# Altium project Ultimaker.PrjPcb (part 1 of 2)
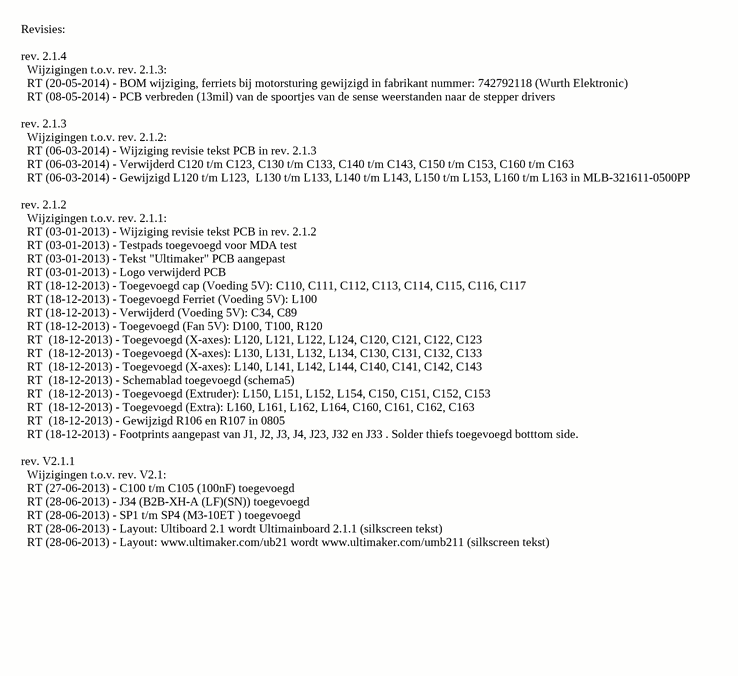
[diagram p0: revisies.SchDoc]
Projectnaam: Bla
6 sheets, 574 parts. Net scope: global (net labels, ports and power ports of the same name join across sheets).
Board file: Ultimaker_V2.1.4.PcbDoc
Sheets:
  revisies.SchDoc
  schema1.SchDoc
  schema2.SchDoc
  schema3.SchDoc
  schema4.SchDoc
  schema5.SchDoc

## Sheet revisies.SchDoc
size A3; ApprovedBy: CdB; CheckedBy: CdB; DrawnBy: RT; Engineer: CdB; Organization: Faber Electronics B.V.; Address1: Th. Dobbeweg 1,; Address2: 6883 GN Velp,; Address3: Netherlands; Address4: T: 026-38 46 800; DocumentNumber: 6; Revision: 2.1.3; SheetNumber: 6; SheetTotal: 6; Status: Final

### Notes on the sheet
- Revisies:
  rev. 2.1.4
  Wijzigingen t.o.v. rev. 2.1.3:
  RT (20-05-2014) - BOM wijziging, ferriets bij motorsturing gewijzigd in fabrikant nummer: 742792118 (Wurth Elektronic)
  RT (08-05-2014) - PCB verbreden (13mil) van de spoortjes van de sense weerstanden naar de stepper drivers
  rev. 2.1.3
  Wijzigingen t.o.v. rev. 2.1.2:
  RT (06-03-2014) - Wijziging revisie tekst PCB in rev. 2.1.3
  RT (06-03-2014) - Verwijderd C120 t/m C123, C130 t/m C133, C140 t/m C143, C150 t/m C153, C160 t/m C163
  RT (06-03-2014) - Gewijzigd L120 t/m L123,  L130 t/m L133, L140 t/m L143, L150 t/m L153, L160 t/m L163 in MLB-321611-0500PP
  rev. 2.1.2
  Wijzigingen t.o.v. rev. 2.1.1:
  RT (03-01-2013) - Wijziging revisie tekst PCB in rev. 2.1.2
  RT (03-01-2013) - Testpads toegevoegd voor MDA test
  RT (03-01-2013) - Tekst "Ultimaker" PCB aangepast
  RT (03-01-2013) - Logo verwijderd PCB
  RT (18-12-2013) - Toegevoegd cap (Voeding 5V): C110, C111, C112, C113, C114, C115, C116, C117
  RT (18-12-2013) - Toegevoegd Ferriet (Voeding 5V): L100
  RT (18-12-2013) - Verwijderd (Voeding 5V): C34, C89
  RT (18-12-2013) - Toegevoegd (Fan 5V): D100, T100, R120
  RT  (18-12-2013) - Toegevoegd (X-axes): L120, L121, L122, L124, C120, C121, C122, C123
  RT  (18-12-2013) - Toegevoegd (X-axes): L130, L131, L132, L134, C130, C131, C132, C133
  RT  (18-12-2013) - Toegevoegd (X-axes): L140, L141, L142, L144, C140, C141, C142, C143
  RT  (18-12-2013) - Schemablad toegevoegd (schema5)
  RT  (18-12-2013) - Toegevoegd (Extruder): L150, L151, L152, L154, C150, C151, C152, C153
  RT  (18-12-2013) - Toegevoegd (Extra): L160, L161, L162, L164, C160, C161, C162, C163
  RT  (18-12-2013) - Gewijzigd R106 en R107 in 0805
  RT (18-12-2013) - Footprints aangepast van J1, J2, J3, J4, J23, J32 en J33 . Solder thiefs toegevoegd botttom side.
  rev. V2.1.1
  Wijzigingen t.o.v. rev. V2.1:
  RT (27-06-2013) - C100 t/m C105 (100nF) toegevoegd
  RT (28-06-2013) - J34 (B2B-XH-A (LF)(SN)) toegevoegd
  RT (28-06-2013) - SP1 t/m SP4 (M3-10ET ) toegevoegd
  RT (28-06-2013) - Layout: Ultiboard 2.1 wordt Ultimainboard 2.1.1 (silkscreen tekst)
  RT (28-06-2013) - Layout: www.ultimaker.com/ub21 wordt www.ultimaker.com/umb211 (silkscreen tekst)
- Project name
- Document Name
- Revision:
- Date:
- Status:
- Engineer:
- Drawing by:
- Time:
- Approved By:
- Checked By:
- Date of approval:
- Sheet
- of
- Size:
- A3
- File:
- F: 026-36 48 244

## Sheet schema1.SchDoc
size A3; ApprovedBy: CdB; CheckedBy: CdB; DrawnBy: RT; Engineer: CdB; Organization: Faber Electronics B.V.; Address1: Th. Dobbeweg 1,; Address2: 6883 GN Velp,; Address3: Netherlands; Address4: T: 026-38 46 800; DocumentNumber: 1; Revision: 2.1.4; SheetNumber: 1; SheetTotal: 6; Status: Final; PageSetup: Record=PageOptions|CenterHorizontal=True|CenterVertical=True|PrintScale=1.01|XCorrection=1.00|YCorrection=1.00|PrintKind=1|BorderSize=5000000|LeftOffset=0|BottomOffset=0|Orientation=2|PaperLength=1000|PaperWidth=1000|Scale=100|PaperSource=7|PrintQuality=1200|MediaType=1|DitherType=10|PaperKind=A3 (297 x 420mm)|PrintScaleMode=1
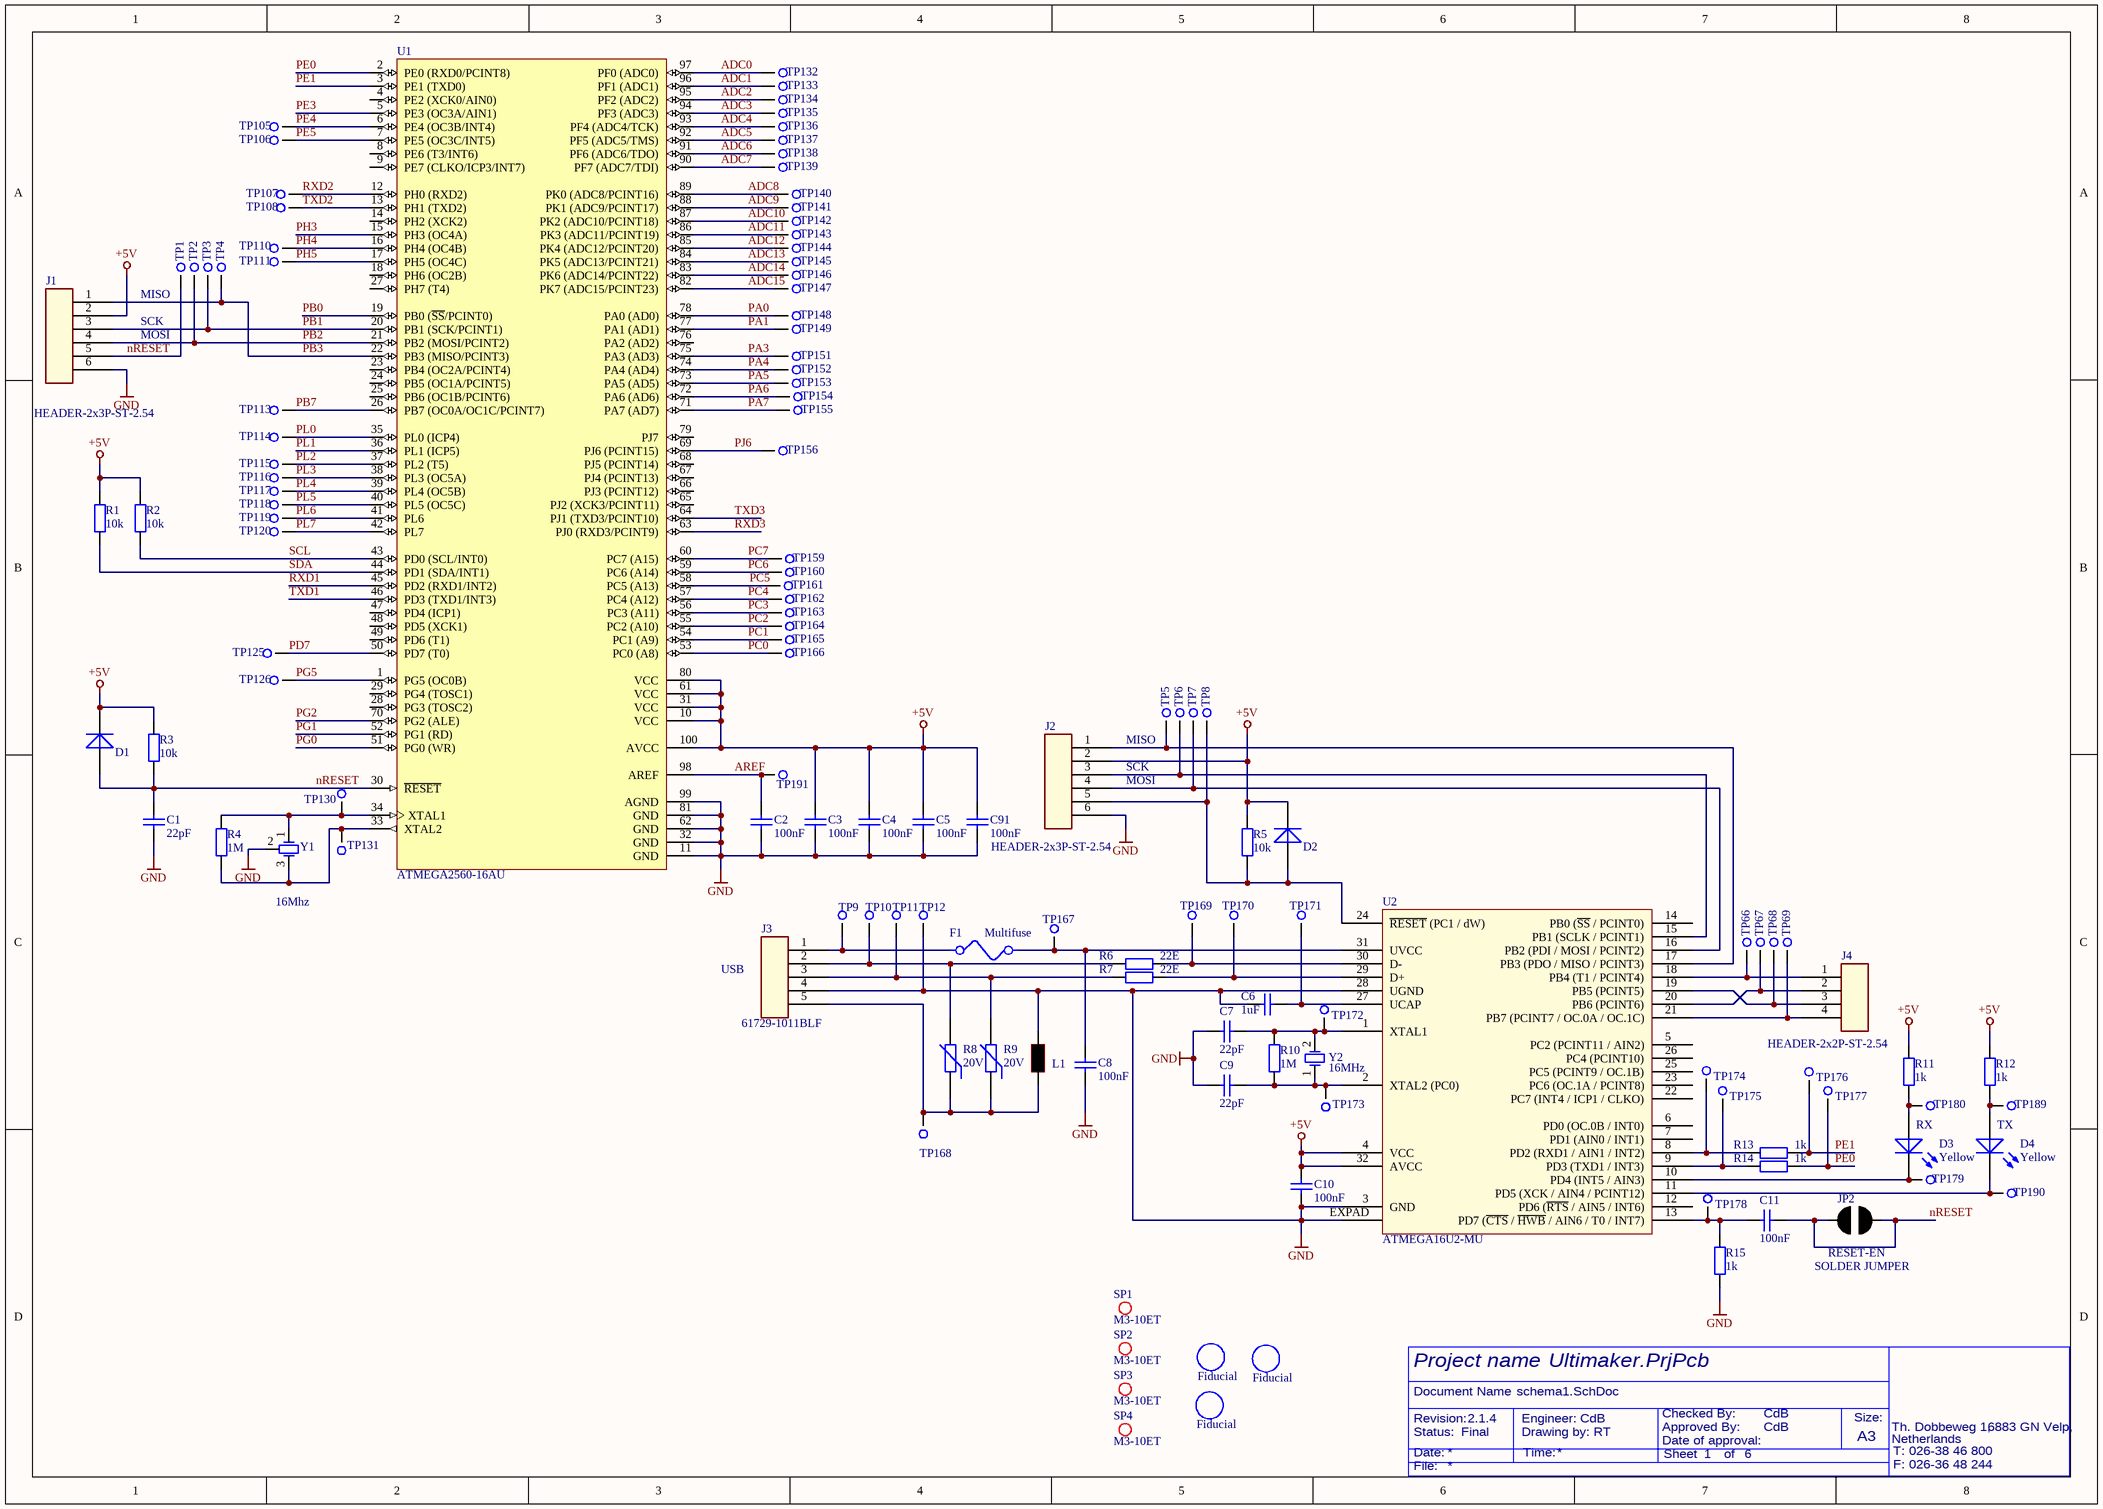
[diagram p1: schema1.SchDoc]

### Parts
C1  22pF  [C0603]
C2  100nF  [C0603]
C3  100nF  [C0603]
C4  100nF  [C0603]
C5  100nF  [C0603]
C6  1uF  [C0603]
C7  22pF  [C0603]
C8  100nF  [C0603]
C9  22pF  [C0603]
C10  100nF  [C0603]
C11  100nF  [C0603]
C91  100nF  [C0603]
D1  1N4148  [SOD323]  (value not drawn)
D2  1N4148  [SOD323]  (value not drawn)
D3  Yellow  [LED0805-YELLOW]
D4  Yellow  [LED0805-YELLOW]
F1  Multifuse  [Multifuse1812]
Fid1  Fiducial  [Fiducial]  (no BOM)
Fid2  Fiducial  [Fiducial]  (no BOM)
Fid3  Fiducial  [Fiducial]  (no BOM)
J1  HEADER-2x3P-ST-2.54  [HEADER-2x3P-ST-2.54]
J2  HEADER-2x3P-ST-2.54  [HEADER-2x3P-ST-2.54]
J3  61729-1011BLF  [61729-1011BLF]
J4  HEADER-2x2P-ST-2.54  [HEADER-2x2P-ST-2.54]
JP2  SOLDER JUMPER  [JUMPER 2 SOLDER]
L1  Bead  [L0805]  (value not drawn)
R1  10k  [R0603]
R2  10k  [R0603]
R3  10k  [R0603]
R4  1M  [R0603]
R5  10k  [R0603]
R6  22E  [R0603]
R7  22E  [R0603]
R8  20V  [R0603]
R9  20V  [R0603]
R10  1M  [R0603]
R11  1k  [R0603]
R12  1k  [R0603]
R13  1k  [R0603]
R14  1k  [R0603]
R15  1k  [R0603]
SP1  M3-10ET  [Spacer M3-10ET]
SP2  M3-10ET  [Spacer M3-10ET]
SP3  M3-10ET  [Spacer M3-10ET]
SP4  M3-10ET  [Spacer M3-10ET]
TP1  Testpoint  [Testpoint]  (value not drawn)
TP2  Testpoint  [Testpoint]  (value not drawn)
TP3  Testpoint  [Testpoint]  (value not drawn)
TP4  Testpoint  [Testpoint]  (value not drawn)
TP5  Testpoint  [Testpoint]  (value not drawn)
TP6  Testpoint  [Testpoint]  (value not drawn)
TP7  Testpoint  [Testpoint]  (value not drawn)
TP8  Testpoint  [Testpoint]  (value not drawn)
TP9  Testpoint  [Testpoint]  (value not drawn)
TP10  Testpoint  [Testpoint]  (value not drawn)
TP11  Testpoint  [Testpoint]  (value not drawn)
TP12  Testpoint  [Testpoint]  (value not drawn)
TP66  Testpoint  [Testpoint]  (value not drawn)
TP67  Testpoint  [Testpoint]  (value not drawn)
TP68  Testpoint  [Testpoint]  (value not drawn)
TP69  Testpoint  [Testpoint]  (value not drawn)
TP105  Testpoint 1.6mm  [Testpoint 1.6mm]  (value not drawn)
TP106  Testpoint 1.6mm  [Testpoint 1.6mm]  (value not drawn)
TP107  Testpoint 1.6mm  [Testpoint 1.6mm]  (value not drawn)
TP108  Testpoint 1.6mm  [Testpoint 1.6mm]  (value not drawn)
TP110  Testpoint 1.6mm  [Testpoint 1.6mm]  (value not drawn)
TP111  Testpoint 1.6mm  [Testpoint 1.6mm]  (value not drawn)
TP113  Testpoint 1.6mm  [Testpoint 1.6mm]  (value not drawn)
TP114  Testpoint 1.6mm  [Testpoint 1.6mm]  (value not drawn)
TP115  Testpoint 1.6mm  [Testpoint 1.6mm]  (value not drawn)
TP116  Testpoint 1.6mm  [Testpoint 1.6mm]  (value not drawn)
TP117  Testpoint 1.6mm  [Testpoint 1.6mm]  (value not drawn)
TP118  Testpoint 1.6mm  [Testpoint 1.6mm]  (value not drawn)
TP119  Testpoint 1.6mm  [Testpoint 1.6mm]  (value not drawn)
TP120  Testpoint 1.6mm  [Testpoint 1.6mm]  (value not drawn)
TP125  Testpoint 1.6mm  [Testpoint 1.6mm]  (value not drawn)
TP126  Testpoint 1.6mm  [Testpoint 1.6mm]  (value not drawn)
TP130  Testpoint 1.6mm  [Testpoint 1.6mm]  (value not drawn)
TP131  Testpoint 1.6mm  [Testpoint 1.6mm]  (value not drawn)
TP132  Testpoint 1.6mm  [Testpoint 1.6mm]  (value not drawn)
TP133  Testpoint 1.6mm  [Testpoint 1.6mm]  (value not drawn)
TP134  Testpoint 1.6mm  [Testpoint 1.6mm]  (value not drawn)
TP135  Testpoint 1.6mm  [Testpoint 1.6mm]  (value not drawn)
TP136  Testpoint 1.6mm  [Testpoint 1.6mm]  (value not drawn)
TP137  Testpoint 1.6mm  [Testpoint 1.6mm]  (value not drawn)
TP138  Testpoint 1.6mm  [Testpoint 1.6mm]  (value not drawn)
TP139  Testpoint 1.6mm  [Testpoint 1.6mm]  (value not drawn)
TP140  Testpoint 1.6mm  [Testpoint 1.6mm]  (value not drawn)
TP141  Testpoint 1.6mm  [Testpoint 1.6mm]  (value not drawn)
TP142  Testpoint 1.6mm  [Testpoint 1.6mm]  (value not drawn)
TP143  Testpoint 1.6mm  [Testpoint 1.6mm]  (value not drawn)
TP144  Testpoint 1.6mm  [Testpoint 1.6mm]  (value not drawn)
TP145  Testpoint 1.6mm  [Testpoint 1.6mm]  (value not drawn)
TP146  Testpoint 1.6mm  [Testpoint 1.6mm]  (value not drawn)
TP147  Testpoint 1.6mm  [Testpoint 1.6mm]  (value not drawn)
TP148  Testpoint 1.6mm  [Testpoint 1.6mm]  (value not drawn)
TP149  Testpoint 1.6mm  [Testpoint 1.6mm]  (value not drawn)
TP151  Testpoint 1.6mm  [Testpoint 1.6mm]  (value not drawn)
TP152  Testpoint 1.6mm  [Testpoint 1.6mm]  (value not drawn)
TP153  Testpoint 1.6mm  [Testpoint 1.6mm]  (value not drawn)
TP154  Testpoint 1.6mm  [Testpoint 1.6mm]  (value not drawn)
TP155  Testpoint 1.6mm  [Testpoint 1.6mm]  (value not drawn)
TP156  Testpoint 1.6mm  [Testpoint 1.6mm]  (value not drawn)
TP159  Testpoint 1.6mm  [Testpoint 1.6mm]  (value not drawn)
TP160  Testpoint 1.6mm  [Testpoint 1.6mm]  (value not drawn)
TP161  Testpoint 1.6mm  [Testpoint 1.6mm]  (value not drawn)
TP162  Testpoint 1.6mm  [Testpoint 1.6mm]  (value not drawn)
TP163  Testpoint 1.6mm  [Testpoint 1.6mm]  (value not drawn)
TP164  Testpoint 1.6mm  [Testpoint 1.6mm]  (value not drawn)
TP165  Testpoint 1.6mm  [Testpoint 1.6mm]  (value not drawn)
TP166  Testpoint 1.6mm  [Testpoint 1.6mm]  (value not drawn)
TP167  Testpoint 1.6mm  [Testpoint 1.6mm]  (value not drawn)
TP168  Testpoint 1.6mm  [Testpoint 1.6mm]  (value not drawn)
TP169  Testpoint 1.6mm  [Testpoint 1.6mm]  (value not drawn)
TP170  Testpoint 1.6mm  [Testpoint 1.6mm]  (value not drawn)
TP171  Testpoint 1.6mm  [Testpoint 1.6mm]  (value not drawn)
TP172  Testpoint 1.6mm  [Testpoint 1.6mm]  (value not drawn)
TP173  Testpoint 1.6mm  [Testpoint 1.6mm]  (value not drawn)
TP174  Testpoint 1.6mm  [Testpoint 1.6mm]  (value not drawn)
TP175  Testpoint 1.6mm  [Testpoint 1.6mm]  (value not drawn)
TP176  Testpoint 1.6mm  [Testpoint 1.6mm]  (value not drawn)
TP177  Testpoint 1.6mm  [Testpoint 1.6mm]  (value not drawn)
TP178  Testpoint 1.6mm  [Testpoint 1.6mm]  (value not drawn)
TP179  Testpoint 1.6mm  [Testpoint 1.6mm]  (value not drawn)
TP180  Testpoint 1.6mm  [Testpoint 1.6mm]  (value not drawn)
TP189  Testpoint 1.6mm  [Testpoint 1.6mm]  (value not drawn)
TP190  Testpoint 1.6mm  [Testpoint 1.6mm]  (value not drawn)
TP191  Testpoint 1.6mm  [Testpoint 1.6mm]  (value not drawn)
U1  ATMEGA2560-16AU  [TSQFP50P1600X1600X120-100N]
U2  ATMEGA16U2-MU  [QFN50P500X500X100-32-EX]
Y1  16Mhz  [CSTC]
Y2  16MHz  [XT49M-2016M]

### Nets
+5V: C3.2 C4.2 C5.2 C10.2 C91.2 D1.2(K) D2.2(K) J1.2 J2.2 R1.1 R2.1 R3.2 R5.1 R11.2 R12.2 U1.10(VCC) U1.31(VCC) U1.61(VCC) U1.80(VCC) U1.100(AVCC) U2.4(VCC) U2.32(AVCC)
GND: C1.1 C2.1 C3.1 C4.1 C5.1 C6.1 C7.1 C8.1 C9.1 C10.1 C91.1 J1.6 J2.6 J3.4 L1.1 R15.2 TP12.1 U1.11(GND) U1.32(GND) U1.62(GND) U1.81(GND) U1.99(AGND) U2.3(GND) U2.28(UGND) U2.EXPAD Y1.2
ADC0: TP132.1 U1.97(PF0_(ADC0))
ADC1: TP133.1 U1.96(PF1_(ADC1))
ADC2: TP134.1 U1.95(PF2_(ADC2))
ADC3: TP135.1 U1.94(PF3_(ADC3))
ADC4: TP136.1 U1.93(PF4_(ADC4/TCK))
ADC5: TP137.1 U1.92(PF5_(ADC5/TMS))
ADC6: TP138.1 U1.91(PF6_(ADC6/TDO))
ADC7: TP139.1 U1.90(PF7_(ADC7/TDI))
ADC8: TP140.1 U1.89(PK0_(ADC8/PCINT16))
ADC9: TP141.1 U1.88(PK1_(ADC9/PCINT17))
ADC10: TP142.1 U1.87(PK2_(ADC10/PCINT18))
ADC11: TP143.1 U1.86(PK3_(ADC11/PCINT19))
ADC12: TP144.1 U1.85(PK4_(ADC12/PCINT20))
ADC13: TP145.1 U1.84(PK5_(ADC13/PCINT21))
ADC14: TP146.1 U1.83(PK6_(ADC14/PCINT22))
ADC15: TP147.1 U1.82(PK7_(ADC15/PCINT23))
AREF: C2.2 TP191.1 U1.98(AREF)
nRESET: C1.2 C11.1 D1.1(A) J1.5 JP2.1 JP2.2 R3.1 TP1.1 U1.30(~{RESET})
PA0: TP148.1 U1.78(PA0_(AD0))
PA1: TP149.1 U1.77(PA1_(AD1))
PA3: TP151.1 U1.75(PA3_(AD3))
PA4: TP152.1 U1.74(PA4_(AD4))
PA5: TP153.1 U1.73(PA5_(AD5))
PA6: TP154.1 U1.72(PA6_(AD6))
PA7: TP155.1 U1.71(PA7_(AD7))
PB0: U1.19(PB0_(~{SS}/PCINT0))
PB1: J1.3 TP3.1 U1.20(PB1_(SCK/PCINT1))
PB2: J1.4 TP2.1 U1.21(PB2_(MOSI/PCINT2))
PB3: J1.1 TP4.1 U1.22(PB3_(MISO/PCINT3))
PB7: TP113.1 U1.26(PB7_(OC0A/OC1C/PCINT7))
PC0: TP166.1 U1.53(PC0_(A8))
PC1: TP165.1 U1.54(PC1_(A9))
PC2: TP164.1 U1.55(PC2_(A10))
PC3: TP163.1 U1.56(PC3_(A11))
PC4: TP162.1 U1.57(PC4_(A12))
PC5: TP161.1 U1.58(PC5_(A13))
PC6: TP160.1 U1.59(PC6_(A14))
PC7: TP159.1 U1.60(PC7_(A15))
PD7: TP125.1 U1.50(PD7_(T0))
PE0: R14.2 TP177.1 U1.2(PE0_(RXD0/PCINT8))
PE1: R13.2 TP176.1 U1.3(PE1_(TXD0))
PE3: U1.5(PE3_(OC3A/AIN1))
PE4: TP105.1 U1.6(PE4_(OC3B/INT4))
PE5: TP106.1 U1.7(PE5_(OC3C/INT5))
PG0: U1.51(PG0_(WR))
PG1: U1.52(PG1_(RD))
PG2: U1.70(PG2_(ALE))
PG5: TP126.1 U1.1(PG5_(OC0B))
PH3: U1.15(PH3_(OC4A))
PH4: TP110.1 U1.16(PH4_(OC4B))
PH5: TP111.1 U1.17(PH5_(OC4C))
PJ6: TP156.1 U1.69(PJ6_(PCINT15))
PL0: TP114.1 U1.35(PL0_(ICP4))
PL1: U1.36(PL1_(ICP5))
PL2: TP115.1 U1.37(PL2_(T5))
PL3: TP116.1 U1.38(PL3_(OC5A))
PL4: TP117.1 U1.39(PL4_(OC5B))
PL5: TP118.1 U1.40(PL5_(OC5C))
PL6: TP119.1 U1.41(PL6)
PL7: TP120.1 U1.42(PL7)
RXD1: U1.45(PD2_(RXD1/INT2))
RXD2: TP107.1 U1.12(PH0_(RXD2))
RXD3: U1.63(PJ0_(RXD3/PCINT9))
SCL: R2.2 U1.43(PD0_(SCL/INT0))
SDA: R1.2 U1.44(PD1_(SDA/INT1))
TXD1: U1.46(PD3_(TXD1/INT3))
TXD2: TP108.1 U1.13(PH1_(TXD2))
TXD3: U1.64(PJ1_(TXD3/PCINT10))
NetC6_2: C6.2 TP171.1 U2.27(UCAP)
NetC7_2: C7.2 R10.2 TP172.1 U2.1(XTAL1) Y2.2
NetC8_2: C8.2 F1.2 TP167.1 U2.31(UVCC)
NetC9_2: C9.2 R10.1 TP173.1 U2.2(XTAL2_(PC0)) Y2.1
NetC11_2: C11.2 R15.1 TP178.1 U2.13(PD7_(~{CTS}_/_~{HWB}_/_AIN6_/_T0_/_INT7))
NetD2_1: D2.1(A) J2.5 R5.2 TP8.1 U2.24(~{RESET}_(PC1_/_dW))
NetD3_1: D3.1(A) R11.1 TP180.1
NetD3_2: D3.2(K) TP179.1 U2.10(PD4_(INT5_/_AIN3))
NetD4_1: D4.1(A) R12.1 TP189.1
NetD4_2: D4.2(K) TP190.1 U2.11(PD5_(XCK_/_AIN4_/_PCINT12))
NetF1_1: F1.1 J3.1 TP9.1
NetJ2_1: J2.1 TP5.1 U2.17(PB3_(PDO_/_MISO_/_PCINT3))
NetJ2_3: J2.3 TP6.1 U2.15(PB1_(SCLK_/_PCINT1))
NetJ2_4: J2.4 TP7.1 U2.16(PB2_(PDI_/_MOSI_/_PCINT2))
NetJ3_2: J3.2 R6.1 R8.2 TP10.1
NetJ3_3: J3.3 R7.1 R9.2 TP11.1
NetJ3_5: J3.5 L1.2 R8.1 R9.1 TP168.1
NetJ4_1: J4.1 TP66.1 U2.18(PB4_(T1_/_PCINT4))
NetJ4_2: J4.2 TP67.1 U2.20(PB6_(PCINT6))
NetJ4_3: J4.3 TP68.1 U2.19(PB5_(PCINT5))
NetJ4_4: J4.4 TP69.1 U2.21(PB7_(PCINT7_/_OC.0A_/_OC.1C))
NetR4_1: R4.1 TP131.1 U1.33(XTAL2) Y1.3
NetR4_2: R4.2 TP130.1 U1.34(XTAL1) Y1.1
NetR6_2: R6.2 TP169.1 U2.30(D-)
NetR7_2: R7.2 TP170.1 U2.29(D+)
NetR13_1: R13.1 TP174.1 U2.8(PD2_(RXD1_/_AIN1_/_INT2))
NetR14_1: R14.1 TP175.1 U2.9(PD3_(TXD1_/_INT3))

Not connected (* = marked no-connect by the designer): U1 4(PE2_(XCK0/AIN0)) 8(PE6_(T3/INT6)) 9(PE7_(CLKO/ICP3/INT7)) 14(PH2_(XCK2)) 18(PH6_(OC2B)) 23(PB4_(OC2A/PCINT4)) 24(PB5_(OC1A/PCINT5)) 25(PB6_(OC1B/PCINT6)) 27(PH7_(T4)) 28(PG3_(TOSC2)) 29(PG4_(TOSC1)) 47(PD4_(ICP1)) 48(PD5_(XCK1)) 49(PD6_(T1)) 65(PJ2_(XCK3/PCINT11)) 66(PJ3_(PCINT12)) 67(PJ4_(PCINT13)) 68(PJ5_(PCINT14)) 76(PA2_(AD2)) 79(PJ7); U2 5(PC2_(PCINT11_/_AIN2)) 6(PD0_(OC.0B_/_INT0)) 7(PD1_(AIN0_/_INT1)) 12(PD6_(~{RTS}_/_AIN5_/_INT6)) 14(PB0_(~{SS}_/_PCINT0)) 22(PC7_(INT4_/_ICP1_/_CLKO)) 23(PC6_(OC.1A_/_PCINT8)) 25(PC5_(PCINT9_/_OC.1B)) 26(PC4_(PCINT10))

### Notes on the sheet
- MISO
- SCK
- MOSI
- (near J3) USB
- RX
- TX
- (near JP2) RESET-EN
- Project name
- Document Name
- Revision:
- Date:
- Status:
- Engineer:
- Drawing by:
- Time:
- Approved By:
- Checked By:
- Date of approval:
- Sheet
- of
- Size:
- A3
- File:
- F: 026-36 48 244

### Library data of the parts
C1 C7 C9 = Library_CAP-0008: RO C0G 22pF 2% 50V  0603; Faber ItemCode: 35321100; ID: Library_CAP-0008; Value: 22pF
C2-C5 C8 C10 C11 C91 = Library_CAP-0002: RO X7R 100nF 10% 50V 0603; Faber ItemCode: 45068500; ID: Library_CAP-0002; Value: 100nF
C6 = Library_CAP-0006: RO X5R 1uF 10% 10V 0603; Faber ItemCode: 36310600; ID: Library_CAP-0006; Value: 1uF
D1 D2 = Library_DIO-0002: RO DIODE 1N4148WS-V-GS08 SOT-323  VISHAY; Faber ItemCode: 36650500; Info: Small Signal Fast Switching Diode; Mfg: VISHAY; ID: Library_DIO-0002; Value: 1N4148
D3 D4 = Library_LED-0003: RO LED GEEL HSMY-C170 0805  AVAGO; Faber ItemCode: 35160800; ID: Library_LED-0003; Mfg: AVAGO; Mfg code: HSMY-C170; Value: Yellow
F1 = Library_FUSE-0001: RO ZEK MULTI 500MA SMD 1812 MF-MSMF050-2 BOURNS; Faber ItemCode: 35502800; Info: MULTIFUSE, SMD, 0.5A; Value: 0.5A; ID: Library_FUSE-0001; Mfg: BOURNS; Mfg code: MF-MSMF050-2
Fid1-Fid3 = Library_MISC-0003: ID: Library_MISC-0003; Faber ItemCode: -; Mfg: -; Mfg code: -; Value: Fiducial
J1 J2 = Library_CON-0003: RO CONN PR HDR 2X3P H4B-06DS-0000 INT; Faber ItemCode: 35149900; ID: Library_CON-0003; Value: HEADER-2x3P-ST-2.54
J3 = Library_CON-0001: RO CONN PR USB-B HKS 61729-1011BLF FCI; Faber ItemCode: 36924400; ID: Library_CON-0001; Mfg: FCI; Mfg code: 61729-1011BLF; Value: 61729-1011BLF
J4 = Library_CON-0011: HDR 2X2P; ID: Library_CON-0011; Value: HEADER-2x2P-ST-2.54
JP2 = Library_CON-0010: ID: Library_CON-0010; Mfg: -; Mfg code: -; Value: SOLDER JUMPER
L1 = Library_COIL-0001: RO FERRIET BLM21PG221SN1D  0805; Faber ItemCode: 36571200; ID: Library_COIL-0001; Value: Bead
R1-R3 R5 = Library_RES-0001: RO RES 10k0 1% 0,063W  0603; Faber ItemCode: 36084500; ID: Library_RES-0001; Info: Resistor; Value: 10k
R4 R10 = Library_RES-0003: RO RES 1M0 1% 0,1W 0603; Faber ItemCode: 36059900; ID: Library_RES-0003; Info: Resistor; Value: 1M
R6 R7 = Library_RES-0007: RO RES 22E0 1% 0,063W 0603; Faber ItemCode: 36108300; ID: Library_RES-0007; Info: Resistor; Value: 22E
R8 R9 = Library_RES-0012: RO VDR 0603 CG0603MLC-05E; Mfg: BOURNS; Faber ItemCode: 36925900; ID: Library_RES-0012; Mfg code: CG0603MLC-05E; Info: Varistor; Value: 20V
R11-R15 = Library_RES-0004: RO RES 1k0 1% 0,1W  0603; Faber ItemCode: 34637900; ID: Library_RES-0004; Info: Resistor; Value: 1k
SP1 = Spacer M3-10ET: MOER-SMD SMTSO-M3-10ET  PEM; Faber ItemCode: 36462900; Bestel grote: 300; Prijs: 0.4311; Mfg: PEM; Mfg code: SMTSO-M3-10ET; Value: -; Remarks: -; Supplier: Onkenhout & Onkenhout; Supplier code: SMTSO-M3-10ET; Max soldering temp: -; SMD: Yes; Faber Artikelomschrijving: MOER-SMD SMTSO-M3-10ET  PEM
SP2-SP4 = Spacer M3-10ET: Spacer SMTSO-M3-10ET; Faber ItemCode: 36462900; Mfg: PEM; Faber Artikelomschrijving: MOER-SMD SMTSO-M3-10ET  PEM; Bestel grote: 300; Prijs: 0.4311; Mfg code: SMTSO-M3-10ET; Value: -; Remarks: -; Supplier: Onkenhout & Onkenhout; Supplier code: SMTSO-M3-10ET; Max soldering temp: -; SMD: Yes
TP1-TP12 TP66-TP69 = Library_MISC-0001: Info: Testpoint, 2mm, round; ID: Library_MISC-0001; Faber ItemCode: -; Mfg: -; Mfg code: -; Value: Testpoint
TP105-TP108 TP110 TP111 TP113-TP120 TP125 TP126 TP130-TP149 TP151-TP156 TP159-TP180 TP189-TP191 = Testpoint 1.6mm: ID: Library_MISC-0001; Faber ItemCode: -; Mfg: -; Mfg code: -; Info: Testpoint 1.6mm; Value: Testpoint 1.6mm
U1 = Library_ICS-0001: RO IC ATMEGA2560-16AU TQFP-100 ATMEL; Info: 8-bit Atmel Microcontroller with 256KB Flash, 4KB EEPROM, 8KB RAM; Faber ItemCode: 36924700; Mfg: Atmel; Mfg code: ATMEGA2560-16AU; ID: Library_ICS-0001; Value: ATMEGA2560-16AU
U2 = Library_ICS-0004: RO IC ATMEGA16U2-MU QFN-32 ATMEL; Info: 8-bit Microcontroller with 16K Bytes of ISP Flash and USB Controller; Faber ItemCode: 36924600; ID: Library_ICS-0004; Mfg: Atmel; Mfg code: ATMEGA16U2-MU; Value: ATMEGA16U2-MU
Y1 = LIBRARY_XTAL-0002: RO KRIS 16MHz CSTCE16M0V53-R0 SMD MURATA; Info: Build in cap; Faber ItemCode: 36925600; ID: LIBRARY_XTAL-0002; Mfg: MURATA; Mfg code: CSTCE16M0V53-R0; Value: 16Mhz
Y2 = LIBRARY_XTAL-0001: RO KRISTAL 16.0MHz  HC49/4HSMX  SMD CMAC; Info: Low Profile SMD Type Crystal Units; Faber ItemCode: 36298900; ID: LIBRARY_XTAL-0001; Mfg: CMAC; Mfg code: XT49M-2016M; Value: 16MHz

## Sheet schema2.SchDoc
size A3; ApprovedBy: CdB; CheckedBy: CdB; DrawnBy: RT; Engineer: CdB; Organization: Faber Electronics B.V.; Address1: Th. Dobbeweg 1,; Address2: 6883 GN Velp,; Address3: Netherlands; Address4: T: 026-38 46 800; DocumentNumber: 2; Revision: 2.1.4; SheetNumber: 2; SheetTotal: 6; Status: Final; PageSetup: Record=PageOptions|CenterHorizontal=True|CenterVertical=True|PrintScale=1.01|XCorrection=1.00|YCorrection=1.00|PrintKind=1|BorderSize=5000000|LeftOffset=0|BottomOffset=0|Orientation=2|PaperLength=1000|PaperWidth=1000|Scale=100|PaperSource=7|PrintQuality=1200|MediaType=1|DitherType=10|PaperKind=A3 (297 x 420mm)|PrintScaleMode=1
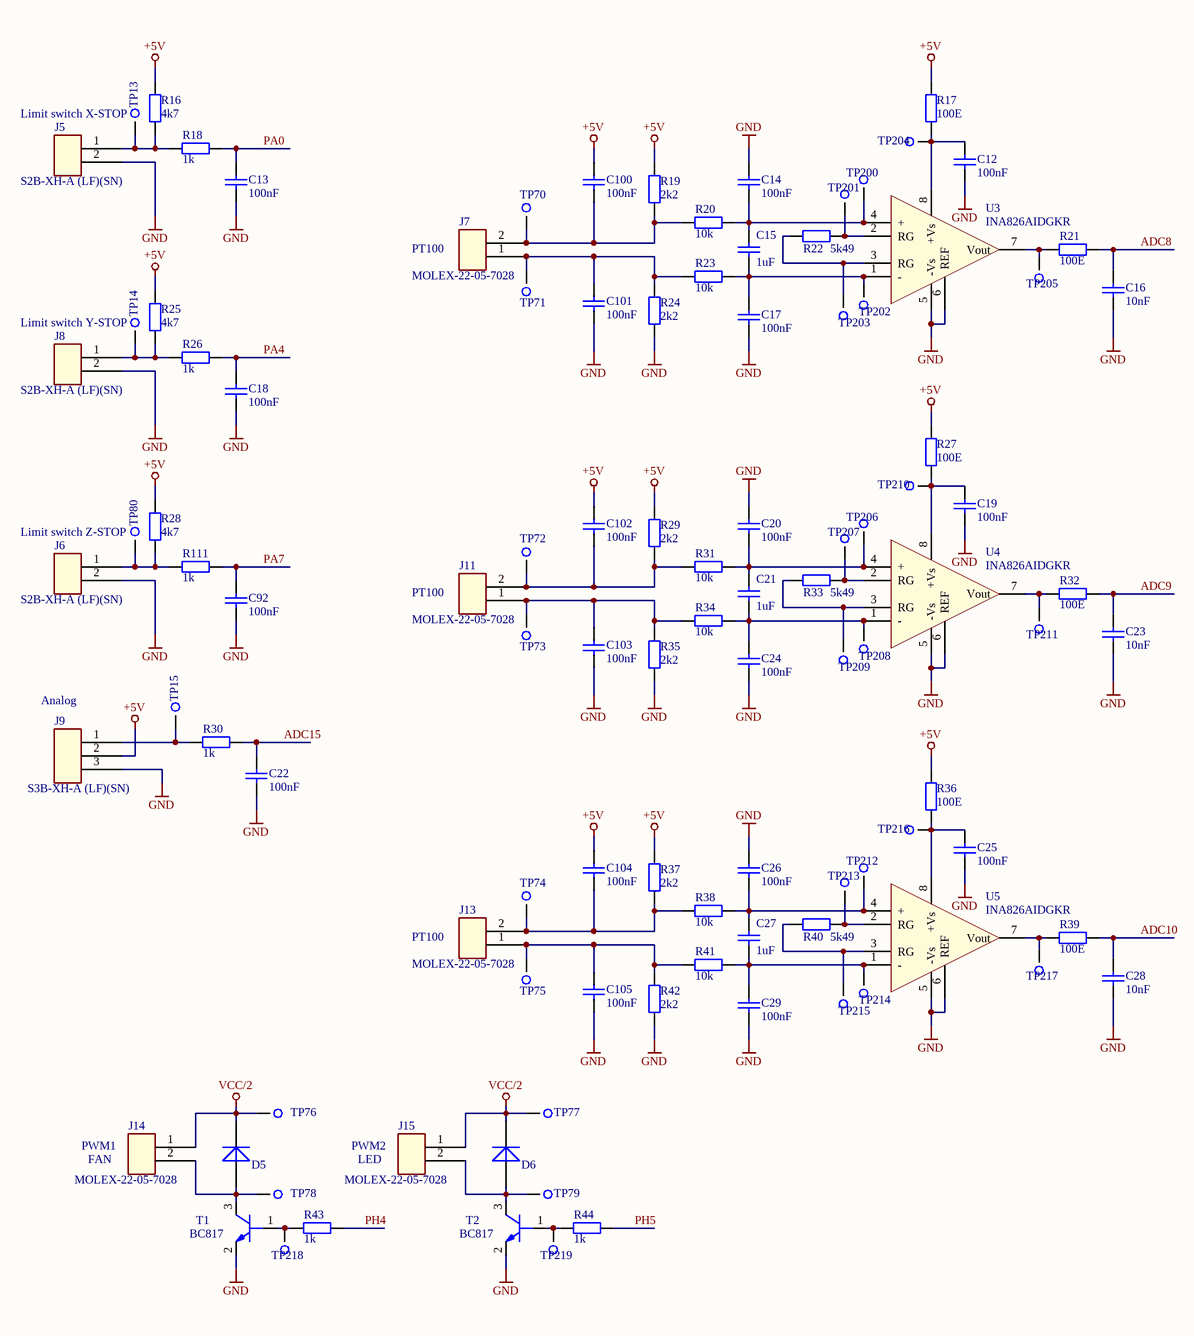
[diagram p2: schema2.SchDoc]

### Parts
C12  100nF  [C0603]
C13  100nF  [C0603]
C14  100nF  [C0603]
C15  1uF  [C0603]
C16  10nF  [C0603]
C17  100nF  [C0603]
C18  100nF  [C0603]
C19  100nF  [C0603]
C20  100nF  [C0603]
C21  1uF  [C0603]
C22  100nF  [C0603]
C23  10nF  [C0603]
C24  100nF  [C0603]
C25  100nF  [C0603]
C26  100nF  [C0603]
C27  1uF  [C0603]
C28  10nF  [C0603]
C29  100nF  [C0603]
C92  100nF  [C0603]
C100  100nF  [C0603]
C101  100nF  [C0603]
C102  100nF  [C0603]
C103  100nF  [C0603]
C104  100nF  [C0603]
C105  100nF  [C0603]
D5  S1G  [DO214AC (SMA)]  (value not drawn)
D6  S1G  [DO214AC (SMA)]  (value not drawn)
J5  S2B-XH-A (LF)(SN)  [S2B-XH-A (LF)(SN)]
J6  S2B-XH-A (LF)(SN)  [S2B-XH-A (LF)(SN)]
J7  MOLEX-22-05-7028  [MOLEX-22-05-7028]
J8  S2B-XH-A (LF)(SN)  [S2B-XH-A (LF)(SN)]
J9  S3B-XH-A (LF)(SN)  [S3B-XH-A (LF)(SN)]
J11  MOLEX-22-05-7028  [MOLEX-22-05-7028]
J13  MOLEX-22-05-7028  [MOLEX-22-05-7028]
J14  MOLEX-22-05-7028  [MOLEX-22-05-7028]
J15  MOLEX-22-05-7028  [MOLEX-22-05-7028]
R16  4k7  [R0603]
R17  100E  [R0603]
R18  1k  [R0603]
R19  2k2  [R0603]
R20  10k  [R0603]
R21  100E  [R0603]
R22  5k49  [R0603]
R23  10k  [R0603]
R24  2k2  [R0603]
R25  4k7  [R0603]
R26  1k  [R0603]
R27  100E  [R0603]
R28  4k7  [R0603]
R29  2k2  [R0603]
R30  1k  [R0603]
R31  10k  [R0603]
R32  100E  [R0603]
R33  5k49  [R0603]
R34  10k  [R0603]
R35  2k2  [R0603]
R36  100E  [R0603]
R37  2k2  [R0603]
R38  10k  [R0603]
R39  100E  [R0603]
R40  5k49  [R0603]
R41  10k  [R0603]
R42  2k2  [R0603]
R43  1k  [R0603]
R44  1k  [R0603]
R111  1k  [R0603]
T1  BC817  [SOT23]
T2  BC817  [SOT23]
TP13  Testpoint  [Testpoint]  (value not drawn)
TP14  Testpoint  [Testpoint]  (value not drawn)
TP15  Testpoint  [Testpoint]  (value not drawn)
TP70  Testpoint  [Testpoint]  (value not drawn)
TP71  Testpoint  [Testpoint]  (value not drawn)
TP72  Testpoint  [Testpoint]  (value not drawn)
TP73  Testpoint  [Testpoint]  (value not drawn)
TP74  Testpoint  [Testpoint]  (value not drawn)
TP75  Testpoint  [Testpoint]  (value not drawn)
TP76  Testpoint  [Testpoint]  (value not drawn)
TP77  Testpoint  [Testpoint]  (value not drawn)
TP78  Testpoint  [Testpoint]  (value not drawn)
TP79  Testpoint  [Testpoint]  (value not drawn)
TP80  Testpoint  [Testpoint]  (value not drawn)
TP200  Testpoint 1.6mm  [Testpoint 1.6mm]  (value not drawn)
TP201  Testpoint 1.6mm  [Testpoint 1.6mm]  (value not drawn)
TP202  Testpoint 1.6mm  [Testpoint 1.6mm]  (value not drawn)
TP203  Testpoint 1.6mm  [Testpoint 1.6mm]  (value not drawn)
TP204  Testpoint 1.6mm  [Testpoint 1.6mm]  (value not drawn)
TP205  Testpoint 1.6mm  [Testpoint 1.6mm]  (value not drawn)
TP206  Testpoint 1.6mm  [Testpoint 1.6mm]  (value not drawn)
TP207  Testpoint 1.6mm  [Testpoint 1.6mm]  (value not drawn)
TP208  Testpoint 1.6mm  [Testpoint 1.6mm]  (value not drawn)
TP209  Testpoint 1.6mm  [Testpoint 1.6mm]  (value not drawn)
TP210  Testpoint 1.6mm  [Testpoint 1.6mm]  (value not drawn)
TP211  Testpoint 1.6mm  [Testpoint 1.6mm]  (value not drawn)
TP212  Testpoint 1.6mm  [Testpoint 1.6mm]  (value not drawn)
TP213  Testpoint 1.6mm  [Testpoint 1.6mm]  (value not drawn)
TP214  Testpoint 1.6mm  [Testpoint 1.6mm]  (value not drawn)
TP215  Testpoint 1.6mm  [Testpoint 1.6mm]  (value not drawn)
TP216  Testpoint 1.6mm  [Testpoint 1.6mm]  (value not drawn)
TP217  Testpoint 1.6mm  [Testpoint 1.6mm]  (value not drawn)
TP218  Testpoint 1.6mm  [Testpoint 1.6mm]  (value not drawn)
TP219  Testpoint 1.6mm  [Testpoint 1.6mm]  (value not drawn)
U3  INA826AIDGKR  [TSOP65P490X110-8N (MSOP8)]
U4  INA826AIDGKR  [TSOP65P490X110-8N (MSOP8)]
U5  INA826AIDGKR  [TSOP65P490X110-8N (MSOP8)]

### Nets
+5V: C100.2 C102.2 C104.2 J9.2 R16.2 R17.1 R19.1 R25.2 R27.1 R28.2 R29.1 R36.1 R37.1
GND: C12.1 C13.1 C14.2 C16.1 C17.1 C18.1 C19.1 C20.2 C22.1 C23.1 C24.1 C25.1 C26.2 C28.1 C29.1 C92.1 C101.1 C103.1 C105.1 J5.2 J6.2 J8.2 J9.3 R24.1 R35.1 R42.1 T1.2(EMITTER) T2.2(EMITTER) U3.5(-Vs) U3.6(REF) U4.5(-Vs) U4.6(REF) U5.5(-Vs) U5.6(REF)
VCC/2: D5.2(K) D6.2(K) J14.1 J15.1 TP76.1 TP77.1
ADC8: C16.2 R21.2
ADC9: C23.2 R32.2
ADC10: C28.2 R39.2
ADC15: C22.2 R30.2
PA0: C13.2 R18.2
PA4: C18.2 R26.2
PA7: C92.2 R111.2
PH4: R43.1
PH5: R44.1
NetC12_2: C12.2 R17.2 TP204.1 U3.8(+Vs)
NetC14_1: C14.1 C15.2 R20.2 TP200.1 U3.4(+)
NetC15_1: C15.1 C17.2 R23.2 TP202.1 U3.1(-)
NetC19_2: C19.2 R27.2 TP210.1 U4.8(+Vs)
NetC20_1: C20.1 C21.2 R31.2 TP206.1 U4.4(+)
NetC21_1: C21.1 C24.2 R34.2 TP208.1 U4.1(-)
NetC25_2: C25.2 R36.2 TP216.1 U5.8(+Vs)
NetC26_1: C26.1 C27.2 R38.2 TP212.1 U5.4(+)
NetC27_1: C27.1 C29.2 R41.2 TP214.1 U5.1(-)
NetC100_1: C100.1 J7.2 R19.2 R20.1 TP70.1
NetC101_2: C101.2 J7.1 R23.1 R24.2 TP71.1
NetC102_1: C102.1 J11.2 R29.2 R31.1 TP72.1
NetC103_2: C103.2 J11.1 R34.1 R35.2 TP73.1
NetC104_1: C104.1 J13.2 R37.2 R38.1 TP74.1
NetC105_2: C105.2 J13.1 R41.1 R42.2 TP75.1
NetD5_1: D5.1(A) J14.2 T1.3(COLLECTOR) TP78.1
NetD6_1: D6.1(A) J15.2 T2.3(COLLECTOR) TP79.1
NetJ5_1: J5.1 R16.1 R18.1 TP13.1
NetJ6_1: J6.1 R28.1 R111.1 TP80.1
NetJ8_1: J8.1 R25.1 R26.1 TP14.1
NetJ9_1: J9.1 R30.1 TP15.1
NetR21_1: R21.1 TP205.1 U3.7(Vout)
NetR22_1: R22.1 TP201.1 U3.2(RG)
NetR22_2: R22.2 TP203.1 U3.3(RG)
NetR32_1: R32.1 TP211.1 U4.7(Vout)
NetR33_1: R33.1 TP207.1 U4.2(RG)
NetR33_2: R33.2 TP209.1 U4.3(RG)
NetR39_1: R39.1 TP217.1 U5.7(Vout)
NetR40_1: R40.1 TP213.1 U5.2(RG)
NetR40_2: R40.2 TP215.1 U5.3(RG)
NetR43_2: R43.2 T1.1(BASE) TP218.1
NetR44_2: R44.2 T2.1(BASE) TP219.1

### Notes on the sheet
- (near TP13) Limit switch X-STOP
- (near J7) PT100
- (near TP14) Limit switch Y-STOP
- (near TP80) Limit switch Z-STOP
- (near J11) PT100
- (near J9) Analog
- (near J13) PT100
- (near J14) PWM1
- (near J14) FAN
- PWM2
- LED
- Project name
- Document Name
- Revision:
- Date:
- Status:
- Engineer:
- Drawing by:
- Time:
- Approved By:
- Checked By:
- Date of approval:
- Sheet
- of
- Size:
- A3
- File:
- F: 026-36 48 244

### Library data of the parts
C12-C14 C17-C20 C22 C24-C26 C29 C92 C100-C105 = Library_CAP-0002: as C2 on sheet schema1; ID: Library_CAP-0002; Value: 100nF
C15 C21 C27 = Library_CAP-0006: as C6 on sheet schema1; ID: Library_CAP-0006; Value: 1uF
C16 C23 C28 = Library_CAP-0007: RO X7R 10nF 10% 50V 0603; Faber ItemCode: 36270400; ID: Library_CAP-0007; Value: 10nF
D5 D6 = Library_DIO-0001: RO DIODE S1G DO-214AC; Faber ItemCode: 32284000; Info: Fast Rectifiers 1A 400V; ID: Library_DIO-0001; Value: S1G
J5 J6 J8 = Library_CON-0004: RO CONN PR 2p HKS S2B-XH-A (LF)(SN) JST; Mfg: JST (JAPAN SOLDERLESS TERMINALS); Faber ItemCode: 36926700; ID: Library_CON-0004; Mfg code: S2B-XH-A (LF)(SN); Value: S2B-XH-A (LF)(SN)
J7 J11 J13-J15 = Library_CON-0006: RO CONN PR 2p HKS 22-05-7028 MOLEX; Info: 2.54mm Pitch KK® Wire-to-Board Header, Right Angle, with Friction Lock, 2 Circuits; Faber ItemCode: 36926400; Mfg: MOLEX; Mfg code: 22-05-7028; ID: Library_CON-0006; Value: MOLEX-22-05-7028
J9 = Library_CON-0020: RO CONN PR 3p HKS S3B-XH-A (LF)(SN) JST; Faber ItemCode: 36948200; Mfg: JST (JAPAN SOLDERLESS TERMINALS); ID: Library_CON-0020; Mfg code: S3B-XH-A (LF)(SN); Value: S3B-XH-A (LF)(SN)
R16 R25 R28 = Library_RES-0002: RO RES 4k70 1% 0,063W  0603; Faber ItemCode: 36257400; ID: Library_RES-0002; Info: Resistor; Value: 4k7
R17 R21 R27 R32 R36 R39 = Library_RES-0006: RO RES 100E 1% 0,063W  0603; Faber ItemCode: 32338800; ID: Library_RES-0006; Info: Resistor; Value: 100E
R18 R26 R30 R43 R44 R111 = Library_RES-0004: as R11 on sheet schema1; ID: Library_RES-0004; Info: Resistor; Value: 1k
R19 R24 R29 R35 R37 R42 = Library_RES-0010: RO RES 2k2 0,1% 0,063W 25ppm 0603; Mfg: TE CONNECTIVITY / NEOHM; Mfg code: CPF0603B2K2E1; Faber ItemCode: 36926600; ID: Library_RES-0010; Info: Resistor; Value: 2k2
R20 R23 R31 R34 R38 R41 = Library_RES-0001: as R1 on sheet schema1; ID: Library_RES-0001; Info: Resistor; Value: 10k
R22 R33 R40 = Library_RES-0011: RO RES 5K49 0,1% 0,063W 25ppm 0603; Mfg: WELWYN; Mfg code: PCF0603R 5K49B.T1; Faber ItemCode: 36926200; ID: Library_RES-0011; Info: Resistor; Value: 5k49
T1 T2 = Library_TRA-0001: RO TRANS BC817-25  SOT-23; Faber ItemCode: 30828000; Info: 45 V, 500 mA NPN general-purpose transistors; ID: Library_TRA-0001; Value: BC817
TP13-TP15 TP70-TP80 = Library_MISC-0001: Info: Testpoint, 2mm, round; ID: Library_MISC-0001; Faber ItemCode: -; Mfg: -; Mfg code: -; Value: Testpoint
TP200-TP219 = Testpoint 1.6mm: ID: Library_MISC-0001; Faber ItemCode: -; Mfg: -; Mfg code: -; Info: Testpoint 1.6mm; Value: Testpoint 1.6mm
U3-U5 = Library_ICS-0003: RO IC INA826AIDGKR MSOP-8 TI; Mfg: Texas Instruments; Info: Precision, 200-µA Supply Current, 2.7-V to 36-V Supply Instrumentation Amplifier with Rail-to-Rail Output; Faber ItemCode: 36926300; Mfg code: INA826AIDGKR; ID: Library_ICS-0003; Value: INA826AIDGKR

## Sheet schema3.SchDoc
size A3; ApprovedBy: CdB; CheckedBy: CdB; DrawnBy: RT; Engineer: CdB; Organization: Faber Electronics B.V.; Address1: Th. Dobbeweg 1,; Address2: 6883 GN Velp,; Address3: Netherlands; Address4: T: 026-38 46 800; DocumentNumber: 3; Revision: 2.1.4; SheetNumber: 3; SheetTotal: 6; Status: Final; PageSetup: Record=PageOptions|CenterHorizontal=True|CenterVertical=True|PrintScale=1.01|XCorrection=1.00|YCorrection=1.00|PrintKind=1|BorderSize=5000000|LeftOffset=0|BottomOffset=0|Orientation=2|PaperLength=1000|PaperWidth=1000|Scale=100|PaperSource=7|PrintQuality=600|MediaType=1|DitherType=10|PaperKind=A3 (297 x 420mm)|PrintScaleMode=1
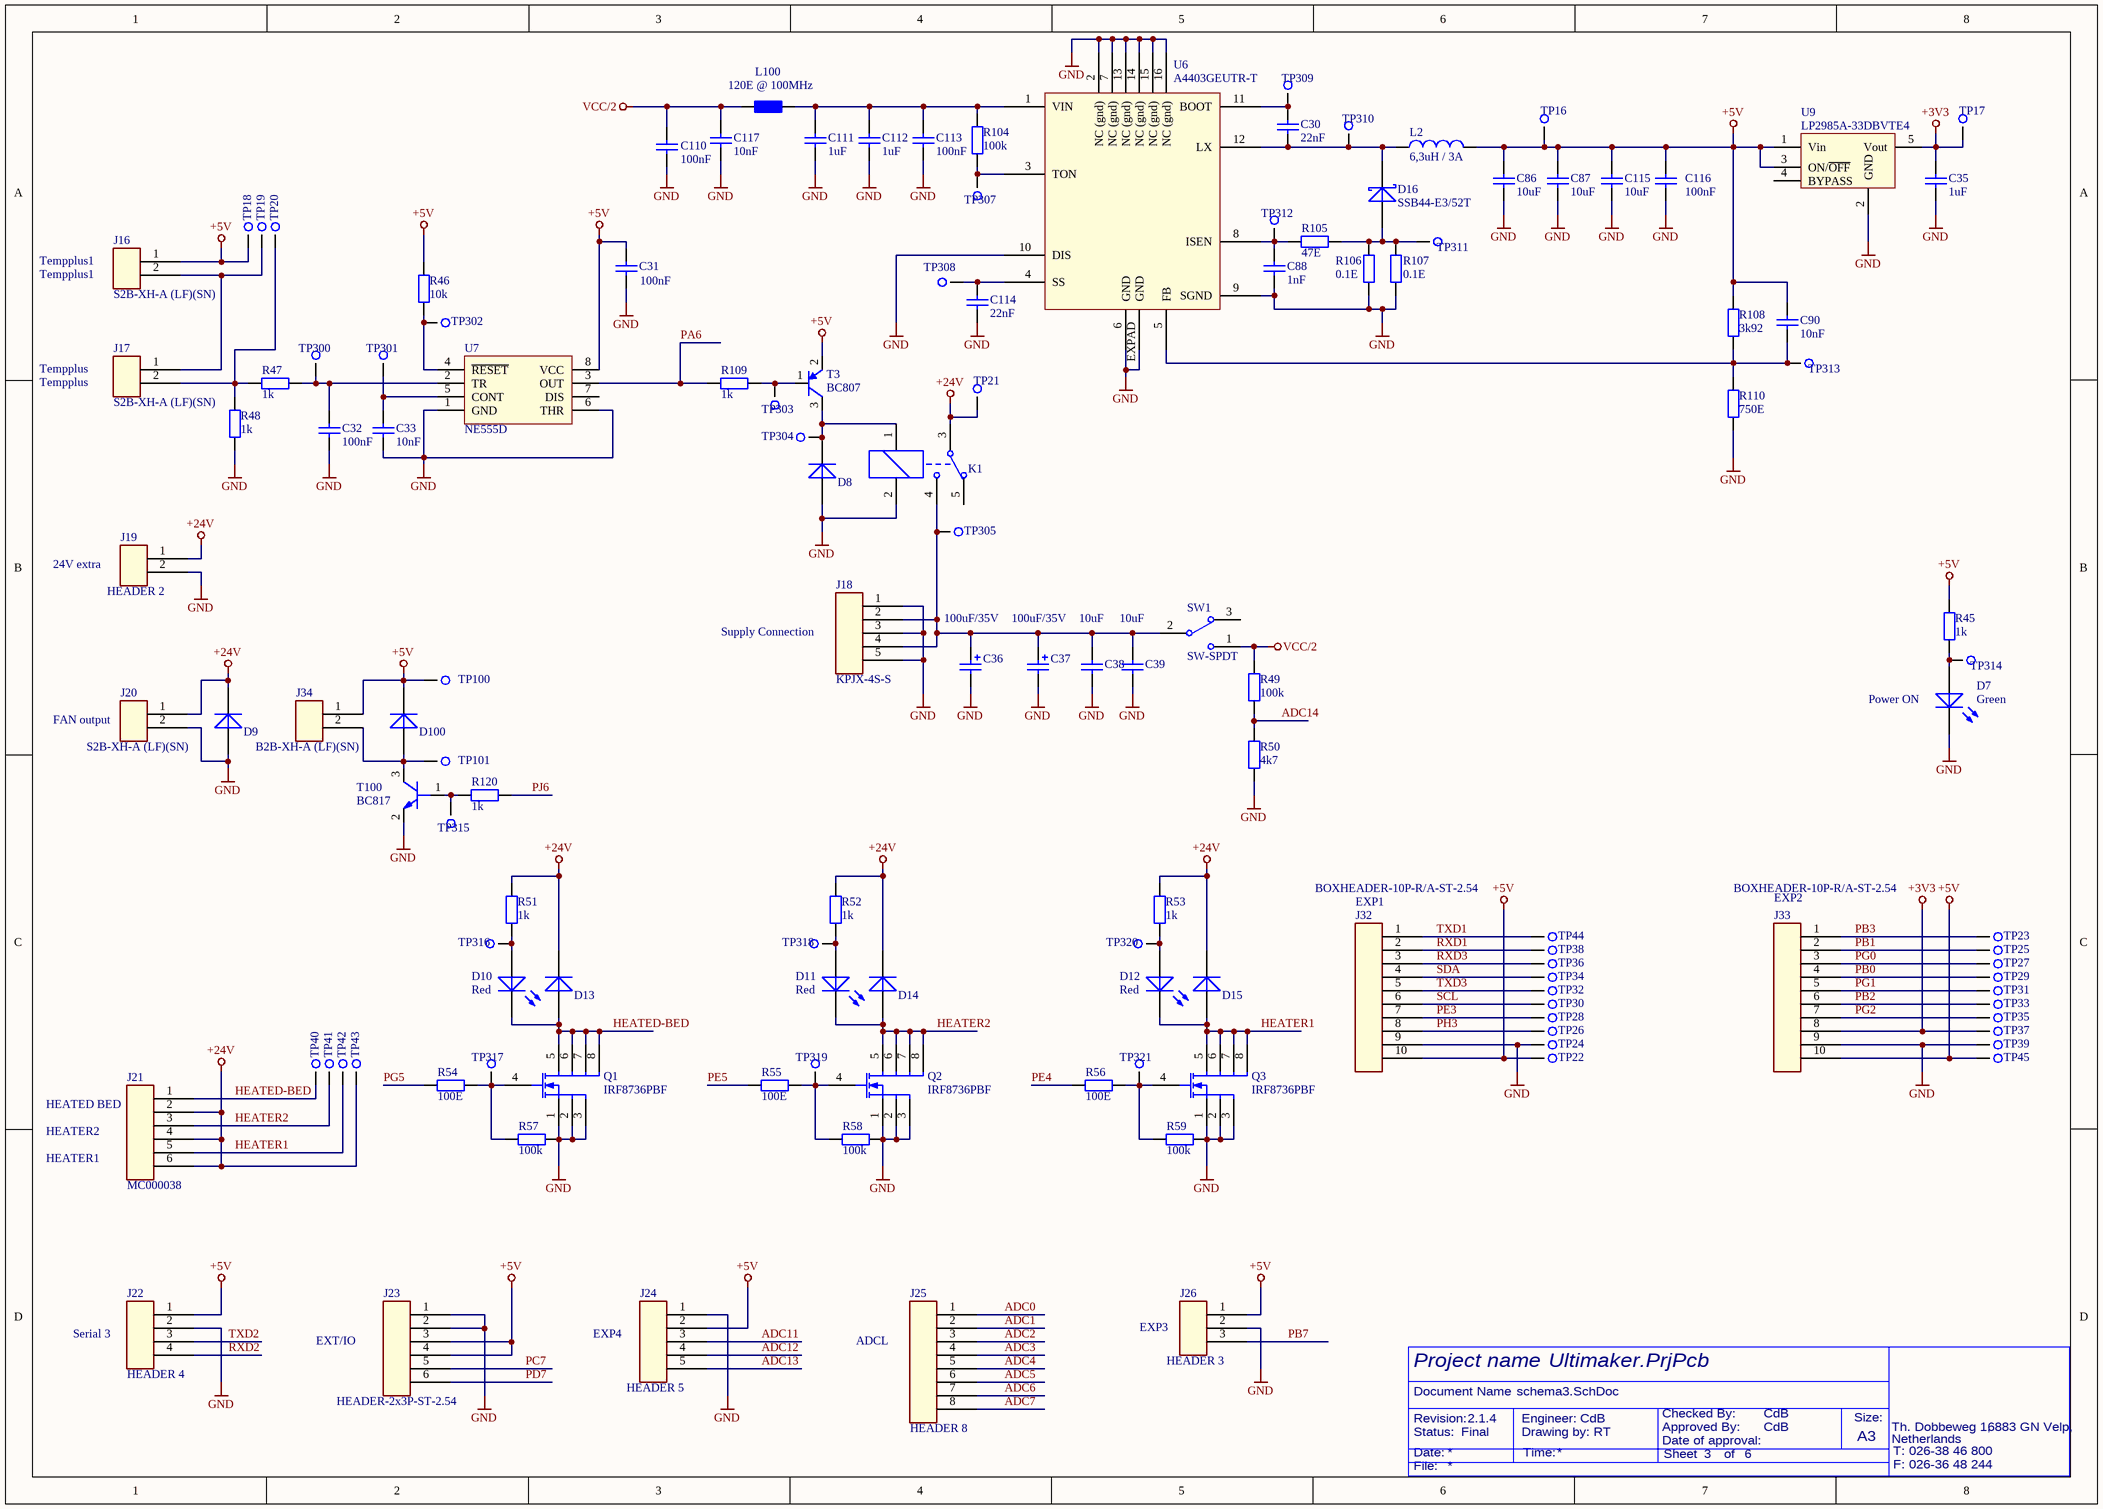
[diagram p3: schema3.SchDoc]

### Parts
C30  22nF  [C0603]
C31  100nF  [C0603]
C32  100nF  [C0603]
C33  10nF  [C0603]
C35  1uF  [C0603]
C36  100uF/35V  [ELCO Case D]
C37  100uF/35V  [ELCO Case D]
C38  10uF  [C1206]
C39  10uF  [C1206]
C86  10uF  [C0805]
C87  10uF  [C0805]
C88  1nF  [C0603]
C90  10nF  [C0603]
C110  100nF  [C0603]
C111  1uF  [C1206]
C112  1uF  [C1206]
C113  100nF  [C0603]
C114  22nF  [C0603]
C115  10uF  [C0805]
C116  100nF  [C0603]
C117  10nF  [C0603]
D7  Green  [LED0805-GREEN]
D8  S1G  [DO214AC (SMA)]  (value not drawn)
D9  S1G  [DO214AC (SMA)]  (value not drawn)
D10  Red  [LED0805-RED]
D11  Red  [LED0805-RED]
D12  Red  [LED0805-RED]
D13  S1G  [DO214AC (SMA)]  (value not drawn)
D14  S1G  [DO214AC (SMA)]  (value not drawn)
D15  S1G  [DO214AC (SMA)]  (value not drawn)
D16  SSB44-E3/52T  [DO214AA (SMB)]
D100  S1G  [DO214AC (SMA)]  (value not drawn)
J16  S2B-XH-A (LF)(SN)  [S2B-XH-A (LF)(SN)]
J17  S2B-XH-A (LF)(SN)  [S2B-XH-A (LF)(SN)]
J18  KPJX-4S-S  [KPJX-4S-S]
J19  HEADER 2  [HEADER-1x2P-ST-2.54]
J20  S2B-XH-A (LF)(SN)  [S2B-XH-A (LF)(SN)]
J21  MC000038  [MC000038]
J22  HEADER 4  [HEADER-1x4P-ST-2.54]
J23  HEADER-2x3P-ST-2.54  [HEADER-2x3P-ST-2.54]
J24  HEADER 5  [HEADER-1x5P-ST-2.54]
J25  HEADER 8  [HEADER-1x8P-ST-2.54]
J26  HEADER 3  [HEADER-1x3P-ST-2.54]
J32  BOXHEADER-10P-R/A-ST-2.54  [BOXHEADER-10P-R/A-ST-2.54]
J33  BOXHEADER-10P-R/A-ST-2.54  [BOXHEADER-10P-R/A-ST-2.54]
J34  B2B-XH-A (LF)(SN)  [B2B-XH-A (LF)(SN)]
K1  Relay-SPDT  [HRS4-S]  (value not drawn)
L2  6,3uH / 3A  [NRS6045]
L100  120E @ 100MHz  [R0603]
Q1  IRF8736PBF  [SOIC127P600X175-8N (SO8)]
Q2  IRF8736PBF  [SOIC127P600X175-8N (SO8)]
Q3  IRF8736PBF  [SOIC127P600X175-8N (SO8)]
R45  1k  [R0603]
R46  10k  [R0603]
R47  1k  [R0603]
R48  1k  [R0603]
R49  100k  [R0603]
R50  4k7  [R0603]
R51  1k  [R0603]
R52  1k  [R0603]
R53  1k  [R0603]
R54  100E  [R0603]
R55  100E  [R0603]
R56  100E  [R0603]
R57  100k  [R0603]
R58  100k  [R0603]
R59  100k  [R0603]
R104  100k  [R0603]
R105  47E  [R0603]
R106  0.1E  [R0805]
R107  0.1E  [R0805]
R108  3k92  [R0603]
R109  1k  [R0603]
R110  750E  [R0603]
R120  1k  [R0603]
SW1  SW-SPDT  [RS 734-6918]
T3  BC807  [SOT23]
T100  BC817  [SOT23]
TP16  Testpoint  [Testpoint]  (value not drawn)
TP17  Testpoint  [Testpoint]  (value not drawn)
TP18  Testpoint  [Testpoint]  (value not drawn)
TP19  Testpoint  [Testpoint]  (value not drawn)
TP20  Testpoint  [Testpoint]  (value not drawn)
TP21  Testpoint  [Testpoint]  (value not drawn)
TP22  Testpoint  [Testpoint]  (value not drawn)
TP23  Testpoint  [Testpoint]  (value not drawn)
TP24  Testpoint  [Testpoint]  (value not drawn)
TP25  Testpoint  [Testpoint]  (value not drawn)
TP26  Testpoint  [Testpoint]  (value not drawn)
TP27  Testpoint  [Testpoint]  (value not drawn)
TP28  Testpoint  [Testpoint]  (value not drawn)
TP29  Testpoint  [Testpoint]  (value not drawn)
TP30  Testpoint  [Testpoint]  (value not drawn)
TP31  Testpoint  [Testpoint]  (value not drawn)
TP32  Testpoint  [Testpoint]  (value not drawn)
TP33  Testpoint  [Testpoint]  (value not drawn)
TP34  Testpoint  [Testpoint]  (value not drawn)
TP35  Testpoint  [Testpoint]  (value not drawn)
TP36  Testpoint  [Testpoint]  (value not drawn)
TP37  Testpoint  [Testpoint]  (value not drawn)
TP38  Testpoint  [Testpoint]  (value not drawn)
TP39  Testpoint  [Testpoint]  (value not drawn)
TP40  Testpoint  [Testpoint]  (value not drawn)
TP41  Testpoint  [Testpoint]  (value not drawn)
TP42  Testpoint  [Testpoint]  (value not drawn)
TP43  Testpoint  [Testpoint]  (value not drawn)
TP44  Testpoint  [Testpoint]  (value not drawn)
TP45  Testpoint  [Testpoint]  (value not drawn)
TP100  Testpoint  [Testpoint]  (value not drawn)
TP101  Testpoint  [Testpoint]  (value not drawn)
TP300  Testpoint 1.6mm  [Testpoint 1.6mm]  (value not drawn)
TP301  Testpoint 1.6mm  [Testpoint 1.6mm]  (value not drawn)
TP302  Testpoint 1.6mm  [Testpoint 1.6mm]  (value not drawn)
TP303  Testpoint 1.6mm  [Testpoint 1.6mm]  (value not drawn)
TP304  Testpoint 1.6mm  [Testpoint 1.6mm]  (value not drawn)
TP305  Testpoint 1.6mm  [Testpoint 1.6mm]  (value not drawn)
TP307  Testpoint 1.6mm  [Testpoint 1.6mm]  (value not drawn)
TP308  Testpoint 1.6mm  [Testpoint 1.6mm]  (value not drawn)
TP309  Testpoint 1.6mm  [Testpoint 1.6mm]  (value not drawn)
TP310  Testpoint 1.6mm  [Testpoint 1.6mm]  (value not drawn)
TP311  Testpoint 1.6mm  [Testpoint 1.6mm]  (value not drawn)
TP312  Testpoint 1.6mm  [Testpoint 1.6mm]  (value not drawn)
TP313  Testpoint 1.6mm  [Testpoint 1.6mm]  (value not drawn)
TP314  Testpoint 1.6mm  [Testpoint 1.6mm]  (value not drawn)
TP315  Testpoint 1.6mm  [Testpoint 1.6mm]  (value not drawn)
TP316  Testpoint 1.6mm  [Testpoint 1.6mm]  (value not drawn)
TP317  Testpoint 1.6mm  [Testpoint 1.6mm]  (value not drawn)
TP318  Testpoint 1.6mm  [Testpoint 1.6mm]  (value not drawn)
TP319  Testpoint 1.6mm  [Testpoint 1.6mm]  (value not drawn)
TP320  Testpoint 1.6mm  [Testpoint 1.6mm]  (value not drawn)
TP321  Testpoint 1.6mm  [Testpoint 1.6mm]  (value not drawn)
U6  A4403GEUTR-T  [QFN65P400X400X80-16N-EX]
U7  NE555D  [SOIC127P600X175-8N (SO8)]
U9  LP2985A-33DBVTE4  [SOT95P280X145-5N (SOT23-5L)]

### Nets
+3V3: C35.2 J33.8 TP17.1 TP37.1 U9.5(Vout)
+5V: C31.2 C86.2 C87.2 C90.2 C115.2 C116.2 D100.2(K) J16.1 J22.1 J23.3 J23.4 J24.2 J26.1 J32.10 J33.10 J34.1 L2.2 R45.2 R46.2 R108.2 T3.2(E) TP16.1 TP18.1 TP22.1 TP45.1 TP100.1 U7.8(VCC) U9.1(Vin) U9.3(ON/~{OFF})
+24V: D9.2(K) D13.2(K) D14.2(K) D15.2(K) J19.1 J20.1 J21.2 J21.4 J21.6 K1.3 R51.2 R52.2 R53.2 TP21.1 TP43.1
GND: C31.1 C32.1 C33.1 C35.1 C36.2 C37.2 C38.1 C39.1 C86.1 C87.1 C88.1 C110.1 C111.1 C112.1 C113.1 C114.1 C115.1 C116.1 C117.1 D7.2(K) D8.1(A) D9.1(A) J18.1 J18.3 J18.5 J19.2 J20.2 J22.2 J23.1 J23.2 J24.1 J26.2 J32.9 J33.9 K1.2 Q1.1(S) Q1.2(S) Q1.3(S) Q2.1(S) Q2.2(S) Q2.3(S) Q3.1(S) Q3.2(S) Q3.3(S) R48.1 R50.1 R57.2 R58.2 R59.2 R106.1 R107.1 R110.1 T100.2(EMITTER) TP24.1 TP39.1 U6.2(NC_(gnd)) U6.6(GND) U6.7(NC_(gnd)) U6.9(SGND) U6.10(DIS) U6.13(NC_(gnd)) U6.14(NC_(gnd)) U6.15(NC_(gnd)) U6.16(NC_(gnd)) U6.EXPAD(GND) U7.1(GND) U7.6(THR) U9.2(GND)
VCC/2: C110.2 C117.2 L100.1 R49.2 SW1.1
ADC0: J25.1
ADC1: J25.2
ADC2: J25.3
ADC3: J25.4
ADC4: J25.5
ADC5: J25.6
ADC6: J25.7
ADC7: J25.8
ADC11: J24.3
ADC12: J24.4
ADC13: J24.5
ADC14: R49.1 R50.2
HEATED-BED: D10.2(K) D13.1(A) J21.1 Q1.5(D) Q1.6(D) Q1.7(D) Q1.8(D) TP40.1
HEATER1: D12.2(K) D15.1(A) J21.5 Q3.5(D) Q3.6(D) Q3.7(D) Q3.8(D) TP42.1
HEATER2: D11.2(K) D14.1(A) J21.3 Q2.5(D) Q2.6(D) Q2.7(D) Q2.8(D) TP41.1
PA6: R109.1 U7.3(OUT)
PB0: J33.4 TP29.1
PB1: J33.2 TP25.1
PB2: J33.6 TP33.1
PB3: J33.1 TP23.1
PB7: J26.3
PC7: J23.5
PD7: J23.6
PE3: J32.7 TP28.1
PE4: R56.1
PE5: R55.1
PG0: J33.3 TP27.1
PG1: J33.5 TP31.1
PG2: J33.7 TP35.1
PG5: R54.1
PH3: J32.8 TP26.1
PJ6: R120.1
RXD1: J32.2 TP38.1
RXD2: J22.4
RXD3: J32.3 TP36.1
SCL: J32.6 TP30.1
SDA: J32.4 TP34.1
TXD1: J32.1 TP44.1
TXD2: J22.3
TXD3: J32.5 TP32.1
NetC30_1: C30.1 D16.2(K) L2.1 TP310.1 U6.12(LX)
NetC30_2: C30.2 TP309.1 U6.11(BOOT)
NetC32_2: C32.2 R47.2 TP300.1 U7.2(TR)
NetC33_2: C33.2 TP301.1 U7.5(CONT)
NetC36_1: C36.1 C37.1 C38.2 C39.2 J18.2 J18.4 K1.4 SW1.2 TP305.1
NetC88_2: C88.2 R105.1 TP312.1 U6.8(ISEN)
NetC90_1: C90.1 R108.1 R110.2 TP313.1 U6.5(FB)
NetC111_2: C111.2 C112.2 C113.2 L100.2 R104.2 U6.1(VIN)
NetC114_2: C114.2 TP308.1 U6.4(SS)
NetD7_1: D7.1(A) R45.1 TP314.1
NetD8_2: D8.2(K) K1.1 T3.3(C) TP304.1
NetD10_1: D10.1(A) R51.1 TP316.1
NetD11_1: D11.1(A) R52.1 TP318.1
NetD12_1: D12.1(A) R53.1 TP320.1
NetD16_1: D16.1(A) R105.2 R106.2 R107.2 TP311.1
NetD100_1: D100.1(A) J34.2 T100.3(COLLECTOR) TP101.1
NetJ16_2: J16.2 J17.1 TP19.1
NetJ17_2: J17.2 R47.1 R48.2 TP20.1
NetQ1_4: Q1.4(G) R54.2 R57.1 TP317.1
NetQ2_4: Q2.4(G) R55.2 R58.1 TP319.1
NetQ3_4: Q3.4(G) R56.2 R59.1 TP321.1
NetR46_1: R46.1 TP302.1 U7.4(~{RESET})
NetR104_1: R104.1 TP307.1 U6.3(TON)
NetR109_2: R109.2 T3.1(B) TP303.1
NetR120_2: R120.2 T100.1(BASE) TP315.1

Not connected (* = marked no-connect by the designer): K1 5; SW1 3; U7 7(DIS); U9 4(BYPASS)

### Notes on the sheet
- (near J16) Tempplus1
- (near J17) Tempplus
- (near J19) 24V extra
- (near J18) Supply Connection
- (near J20) FAN output
- (near D7) Power ON
- (near J32) EXP1
- (near J33) EXP2
- (near J21) HEATED BED
- HEATER1
- HEATER2
- (near J22) Serial 3
- EXT/IO
- (near J24) EXP4
- ADCL
- (near J26) EXP3
- Project name
- Document Name
- Revision:
- Date:
- Status:
- Engineer:
- Drawing by:
- Time:
- Approved By:
- Checked By:
- Date of approval:
- Sheet
- of
- Size:
- A3
- File:
- F: 026-36 48 244

### Library data of the parts
C30 C114 = Library_CAP-0011: RO X7R 22nF 10% 0603 50V CC0603KRX7R9BB223; Faber ItemCode: 36795200; ID: Library_CAP-0011; Value: 22nF
C31 C32 C110 C113 C116 = Library_CAP-0002: as C2 on sheet schema1; ID: Library_CAP-0002; Value: 100nF
C33 C90 C117 = Library_CAP-0007: as C16 on sheet schema2; ID: Library_CAP-0007; Value: 10nF
C35 = Library_CAP-0006: as C6 on sheet schema1; ID: Library_CAP-0006; Value: 1uF
C36 C37 = Library_CAP-0004: RO ELCO 100uF 20% 35V CASE-D EEEFP PAN; Faber ItemCode: 36865800; ID: Library_CAP-0004; Value: 100uF/35V
C38 C39 = Library_CAP-0005: RO X5R 10UF 10% 35V 1206; Faber ItemCode: 35436800; ID: Library_CAP-0005; Value: 10uF
C86 C87 C115 = Library_CAP-0012: 6R3R15X106KV4E - MLCC, 0805, X5R, 6.3V, 10UF; Mfg: JOHANSON DIELECTRICS; ID: Library_CAP-0012; Mfg code: 6R3R15X106KV4E; Value: 10uF
C88 = Library_CAP-0013: RO C0G 1nF 5% 50V 0603; Faber ItemCode: 35288300; ID: Library_CAP-0013; Value: 1nF
C111 C112 = Capacitor_1_1: X7R 1uF 10% 50V 1206 GRM31; ID: Library_CAP-0005; Faber ItemCode: 35387100; Value: 1uF
D7 = Library_LED-0002: RO LED GROEN HSMG-C170 0805 AVAGO; Faber ItemCode: 35162200; Mfg: AVAGO; Mfg code: HSMG-C170; ID: Library_LED-0002; Value: Green
D8 D9 D13-D15 D100 = Library_DIO-0001: as D5 on sheet schema2; ID: Library_DIO-0001; Value: S1G
D10-D12 = Library_LED-0001: RO LED ROOD HSMH-C170 0805 AVAGO; Faber ItemCode: 35162100; Mfg: AVAGO; Mfg code: HSMH-C170; ID: Library_LED-0001; Value: Red
D16 = Library_DIO-0003: RO DIODE SSB44-E3/52T SMB VISHAY; Info: High-Current Density Surface Mount Schottky Rectifier; Faber ItemCode: 36925500; ID: Library_DIO-0003; Mfg: VISHAY; Mfg code: SSB44-E3/52T; Value: SSB44-E3/52T
J16 J17 J20 = Library_CON-0004: as J5 on sheet schema2; Mfg code: S2B-XH-A (LF)(SN); ID: Library_CON-0004; Value: S2B-XH-A (LF)(SN)
J18 = Library_CON-0009: RO CONN PR KPJX-4S-S KYCON; Info: Shielded version; Faber ItemCode: 36925000; Mfg: KYCON; Mfg code: KPJX-4S-S; ID: Library_CON-0009; Value: KPJX-4S-S
J19 = Library_CON-0013: HEADER-1x2P-ST-2.54; ID: Library_CON-0013; Value: HEADER 2
J21 = Library_CON-0008: RO CONN PR 6p MC000038 MULTICOMP; Faber ItemCode: 36925200; Mfg: MULTICOMP; Mfg code: MC000038; ID: Library_CON-0008; Value: MC000038
J22 = Library_CON-0014: HEADER-1x4P-ST-2.54; ID: Library_CON-0014; Value: HEADER 4
J23 = Library_CON-0003: as J1 on sheet schema1; ID: Library_CON-0003; Value: HEADER-2x3P-ST-2.54
J24 = Library_CON-0015: HEADER-1x5P-ST-2.54; ID: Library_CON-0015; Value: HEADER 5
J25 = Library_CON-0016: HEADER-1x8P-ST-2.54; ID: Library_CON-0016; Value: HEADER 8
J26 = Library_CON-0017: HEADER-1x3P-ST-2.54; ID: Library_CON-0017; Value: HEADER 3
J32 J33 = Library_CON-0019: RO CONN PR HDR BOX 10p HKS 61201021721 WUERTH; Faber ItemCode: 36925800; ID: Library_CON-0019; Value: BOXHEADER-10P-R/A-ST-2.54
J34 = HEADER 2_3: CONN PR 2p B2B-XH-A JST; ID: Library_CON-0004; Mfg: JST (JAPAN SOLDERLESS TERMINALS); Faber ItemCode: 36863500; Mfg code: B2B-XH-A (LF)(SN); Value: B2B-XH-A (LF)(SN)
K1 = Library_REL-0001: RO REL 5V HRS4-S DC5V MULTICOMP; Faber ItemCode: 36924900; ID: Library_REL-0001; Mfg: MULTICOMP; Mfg code: HRS4-S DC5V; Value: HRS4-S
L2 = Library_COIL-0002: RO SPOEL 6,3uH 20% NRS6045T 6R3MMGK TAIYO YUDEN; Faber ItemCode: 36925300; ID: Library_COIL-0002; Mfg code: NRS6045T 6R3MMGK; Value: 6,3uH / 3A; Mfg: TAIYO YUDEN
L100 = Ferriet Bead 120E: FERRIET BLM18PG121SN1D 0603 MURATA; Info: Resistor; ID: -; Faber ItemCode: -; Value: 120E @ 100MHz; Mfg: Murata; Mfg code: BLM18PG121SN1D
Q1-Q3 = LIBRARY_FET-0002: IRF8736PBF - MOSFET, N SO-8; Mfg: INTERNATIONAL RECTIFIER; Info: HEXFET Power MOSFET; Faber ItemCode: 36926000; Mfg code: IRF8736PBF; ID: LIBRARY_FET-0002; Value: IRF8736PBF
R45 R47 R48 R51-R53 R109 R120 = Library_RES-0004: as R11 on sheet schema1; ID: Library_RES-0004; Info: Resistor; Value: 1k
R46 = Library_RES-0001: as R1 on sheet schema1; ID: Library_RES-0001; Info: Resistor; Value: 10k
R49 R57-R59 R104 = Library_RES-0005: RO RES 100k0 1% 0,063W  0603; Faber ItemCode: 36257800; ID: Library_RES-0005; Info: Resistor; Value: 100k
R50 = Library_RES-0002: as R16 on sheet schema2; ID: Library_RES-0002; Info: Resistor; Value: 4k7
R54-R56 = Library_RES-0006: as R17 on sheet schema2; ID: Library_RES-0006; Info: Resistor; Value: 100E
R105 = Library_RES-0017: RO RES 47E 1% 0,063W 0603; Faber ItemCode: 35030300; ID: Library_RES-0017; Info: Resistor; Value: 47E
R106 R107 = Library_RES-0016: RES 0E10 1% 0,125W 0805; Faber ItemCode: 35343500; ID: Library_RES-0016; Mfg: -; Mfg code: -; Info: Resistor; Value: 0.1E
R108 = Library_RES-0014: RO RES 3k92 1% 0.063W 0603; Faber ItemCode: 36767900; ID: Library_RES-0014; Info: Resistor; Value: 3k92
R110 = Library_RES-0015: RO RES 750E 1% 0,063W 0603; Faber ItemCode: 35154200; ID: Library_RES-0015; Info: Resistor; Value: 750E
SW1 = Library_SWI-0001: Rocker switch,SPDT,on-none-on,RA,snap-in; Mfg: RS Components; Mfg code: 4MS1R202BM6NQNS; Faber ItemCode: 36925400; ID: Library_SWI-0001; Value: SPDT
T3 = Library_TRA-0002: RO TRANS BC807-40  SOT-23; Faber ItemCode: 30827800; Info: 45 V, 500 mA PNP general-purpose transistors; ID: Library_TRA-0002; Value: BC807
T100 = Library_TRA-0001: as T1 on sheet schema2; ID: Library_TRA-0001; Value: BC817
TP16-TP45 TP100 TP101 = Library_MISC-0001: Info: Testpoint, 2mm, round; ID: Library_MISC-0001; Faber ItemCode: -; Mfg: -; Mfg code: -; Value: Testpoint
TP300-TP305 TP307-TP321 = Testpoint 1.6mm: ID: Library_MISC-0001; Faber ItemCode: -; Mfg: -; Mfg code: -; Info: Testpoint 1.6mm; Value: Testpoint 1.6mm
U6 = Library_ICS-0010: RO IC A4403GEUTR-T QFN-16 ALLEGRO; Info: Valley Current Mode Control Buck Converter; Faber ItemCode: 36924500; ID: Library_ICS-0010; Mfg: Allegro; Mfg code: A4403GEUTR-T; Value: A4403GEUTR-T
U7 = Library_ICS-0009: RO IC NE555D SO-08 TI; Faber ItemCode: 35318300; Mfg: Texas Instruments; Mfg code: SE555DRG4; Info: PRECISION TIMER; ID: Library_ICS-0009; Value: NE555D
U9 = Library_ICS-0008: RO STABI LP2985A-33DBVTE4 SOT-23-5 TI; Mfg: Texas Instruments; Info: 150-mA LOW-NOISE LOW-DROPOUT REGULATOR WITH SHUTDOWN; Faber ItemCode: 36925100; Mfg code: LP2985A-33DBVTE4; ID: Library_ICS-0008; Value: LP2985A-33DBVTE4